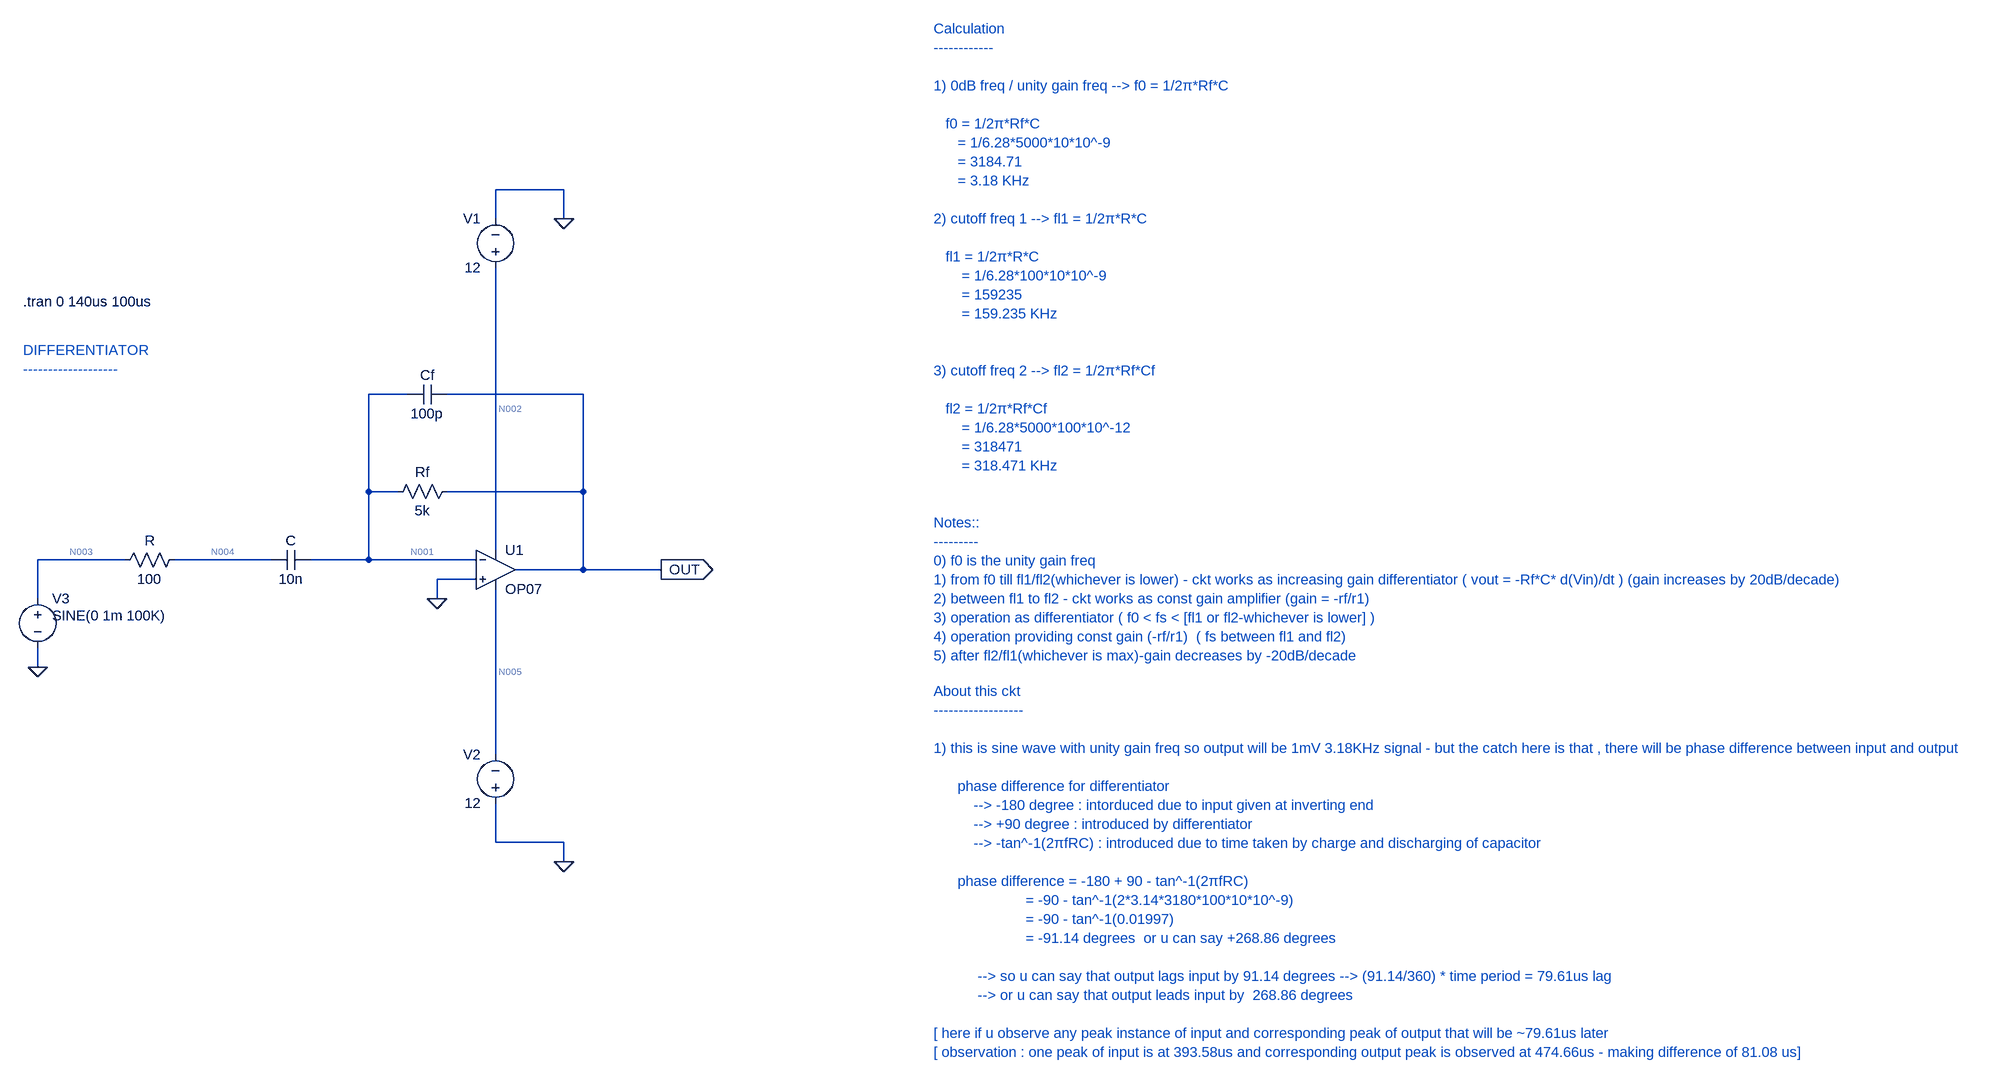
[diagram p0: schematic Op_amp_as_DIFFERENTIATOR_with_AC_input_at_freq_less_than_cutoff_freq.asc]
Op_amp_as_DIFFERENTIATOR_with_AC_input_at_freq_less_than_cutoff_freq.asc, the LTspice schematic file:
Version 4.1
SHEET 1 3496 1680
WIRE 192 -544 80 -544
WIRE 80 -496 80 -544
WIRE 192 -496 192 -544
WIRE -64 -208 -128 -208
WIRE 224 -208 0 -208
WIRE -128 -48 -128 -208
WIRE -80 -48 -128 -48
WIRE 224 -48 224 -208
WIRE 224 -48 0 -48
WIRE 80 48 80 -416
WIRE -528 64 -672 64
WIRE -288 64 -448 64
WIRE -128 64 -128 -48
WIRE -128 64 -224 64
WIRE 48 64 -128 64
WIRE 224 80 224 -48
WIRE 224 80 112 80
WIRE 352 80 224 80
WIRE 48 96 -16 96
WIRE -672 128 -672 64
WIRE -16 128 -16 96
WIRE -672 240 -672 208
WIRE 80 384 80 112
WIRE 80 528 80 464
WIRE 192 528 80 528
WIRE 192 560 192 528
FLAG 192 -496 0
FLAG 192 560 0
FLAG -672 240 0
FLAG 352 80 OUT
IOPIN 352 80 Out
FLAG -16 128 0
SYMBOL voltage 80 -400 R180
WINDOW 0 24 96 Left 2
WINDOW 3 24 16 Left 2
WINDOW 123 0 0 Left 0
WINDOW 39 0 0 Left 0
SYMATTR InstName V1
SYMATTR Value 12
SYMBOL voltage 80 480 R180
WINDOW 0 24 96 Left 2
WINDOW 3 24 16 Left 2
WINDOW 123 0 0 Left 0
WINDOW 39 0 0 Left 0
SYMATTR InstName V2
SYMATTR Value 12
SYMBOL OpAmps\\OP07 80 16 R0
SYMATTR InstName U1
SYMBOL res -432 48 R90
WINDOW 0 0 56 VBottom 2
WINDOW 3 32 56 VTop 2
SYMATTR InstName R
SYMATTR Value 100
SYMBOL voltage -672 112 R0
WINDOW 123 0 0 Left 0
WINDOW 39 0 0 Left 0
WINDOW 3 24 44 Left 2
SYMATTR Value SINE(0 1m 100K)
SYMATTR InstName V3
SYMBOL cap -224 48 R90
WINDOW 0 0 32 VBottom 2
WINDOW 3 32 32 VTop 2
SYMATTR InstName C
SYMATTR Value 10n
SYMBOL res 16 -64 R90
WINDOW 0 0 56 VBottom 2
WINDOW 3 32 56 VTop 2
SYMATTR InstName Rf
SYMATTR Value 5k
SYMBOL cap 0 -224 R90
WINDOW 0 0 32 VBottom 2
WINDOW 3 32 32 VTop 2
SYMATTR InstName Cf
SYMATTR Value 100p
TEXT -696 -360 Left 2 !.tran 0 140us 100us
TEXT -696 -280 Left 2 ;DIFFERENTIATOR\n-------------------
TEXT 800 -808 Left 2 ;Calculation\n------------\n \n1) 0dB freq / unity gain freq --> f0 = 1/2π*Rf*C\n \n   f0 = 1/2π*Rf*C\n      = 1/6.28*5000*10*10^-9\n      = 3184.71\n      = 3.18 KHz\n \n2) cutoff freq 1 --> fl1 = 1/2π*R*C\n \n   fl1 = 1/2π*R*C\n       = 1/6.28*100*10*10^-9\n       = 159235\n       = 159.235 KHz\n \n \n3) cutoff freq 2 --> fl2 = 1/2π*Rf*Cf\n \n   fl2 = 1/2π*Rf*Cf\n       = 1/6.28*5000*100*10^-12\n       = 318471\n       = 318.471 KHz\n \n \nNotes::\n---------\n0) f0 is the unity gain freq\n1) from f0 till fl1/fl2(whichever is lower) - ckt works as increasing gain differentiator ( vout = -Rf*C* d(Vin)/dt ) (gain increases by 20dB/decade)\n2) between fl1 to fl2 - ckt works as const gain amplifier (gain = -rf/r1)\n3) operation as differentiator ( f0 < fs < [fl1 or fl2-whichever is lower] )\n4) operation providing const gain (-rf/r1)  ( fs between fl1 and fl2)\n5) after fl2/fl1(whichever is max)-gain decreases by -20dB/decade
TEXT 800 280 Left 2 ;About this ckt\n------------------\n \n1) this is sine wave with unity gain freq so output will be 1mV 3.18KHz signal - but the catch here is that , there will be phase difference between input and output\n \n      phase difference for differentiator \n          --> -180 degree : intorduced due to input given at inverting end\n          --> +90 degree : introduced by differentiator\n          --> -tan^-1(2πfRC) : introduced due to time taken by charge and discharging of capacitor \n \n      phase difference = -180 + 90 - tan^-1(2πfRC)\n                       = -90 - tan^-1(2*3.14*3180*100*10*10^-9)\n                       = -90 - tan^-1(0.01997)\n                       = -91.14 degrees  or u can say +268.86 degrees\n \n           --> so u can say that output lags input by 91.14 degrees --> (91.14/360) * time period = 79.61us lag \n           --> or u can say that output leads input by  268.86 degrees       \n \n[ here if u observe any peak instance of input and corresponding peak of output that will be ~79.61us later\n[ observation : one peak of input is at 393.58us and corresponding output peak is observed at 474.66us - making difference of 81.08 us]

The netlist it stands for:
* Op_amp_as_DIFFERENTIATOR_with_AC_input_at_freq_less_than_cutoff_freq.asc
V1 N002 0 12
V2 0 N005 12
X§U1 0 N001 N002 N005 OUT LT1001  ; OP07, pins In+ In- V+ V- OUT
R N004 N003 100
V3 N003 0 SINE(0 1m 100K)
C N001 N004 10n
Rf OUT N001 5k
Cf OUT N001 100p
.tran 0 140us 100us
* DIFFERENTIATOR
* -------------------
* Calculation
* ------------
* 1) 0dB freq / unity gain freq --> f0 = 1/2π*Rf*C
*    f0 = 1/2π*Rf*C
*       = 1/6.28*5000*10*10^-9
*       = 3184.71
*       = 3.18 KHz
* 2) cutoff freq 1 --> fl1 = 1/2π*R*C
*    fl1 = 1/2π*R*C
*        = 1/6.28*100*10*10^-9
*        = 159235
*        = 159.235 KHz
* 3) cutoff freq 2 --> fl2 = 1/2π*Rf*Cf
*    fl2 = 1/2π*Rf*Cf
*        = 1/6.28*5000*100*10^-12
*        = 318471
*        = 318.471 KHz
* Notes::
* ---------
* 0) f0 is the unity gain freq
* 1) from f0 till fl1/fl2(whichever is lower) - ckt works as increasing gain differentiator ( vout = -Rf*C* d(Vin)/dt ) (gain increases by 20dB/decade)
* 2) between fl1 to fl2 - ckt works as const gain amplifier (gain = -rf/r1)
* 3) operation as differentiator ( f0 < fs < [fl1 or fl2-whichever is lower] )
* 4) operation providing const gain (-rf/r1)  ( fs between fl1 and fl2)
* 5) after fl2/fl1(whichever is max)-gain decreases by -20dB/decade
* About this ckt
* ------------------
* 1) this is sine wave with unity gain freq so output will be 1mV 3.18KHz signal - but the catch here is that , there will be phase difference between input and output
*       phase difference for differentiator
*           --> -180 degree : intorduced due to input given at inverting end
*           --> +90 degree : introduced by differentiator
*           --> -tan^-1(2πfRC) : introduced due to time taken by charge and discharging of capacitor
*       phase difference = -180 + 90 - tan^-1(2πfRC)
*                        = -90 - tan^-1(2*3.14*3180*100*10*10^-9)
*                        = -90 - tan^-1(0.01997)
*                        = -91.14 degrees  or u can say +268.86 degrees
*            --> so u can say that output lags input by 91.14 degrees --> (91.14/360) * time period = 79.61us lag
*            --> or u can say that output leads input by  268.86 degrees
* [ here if u observe any peak instance of input and corresponding peak of output that will be ~79.61us later
* [ observation : one peak of input is at 393.58us and corresponding output peak is observed at 474.66us - making difference of 81.08 us]
.lib LTC.lib
.backanno
.end

* Results of the author's LTspice run, read from the files saved beside the schematic
* Operating Point, zero values left out:
*   V(n005) = -12 V
*   V(n002) = 12 V
*   I(V1) = -2.25 mA
*   I(V2) = -2.25 mA
*   Ix(u1:3) = 2.25 mA
*   Ix(u1:4) = -2.25 mA
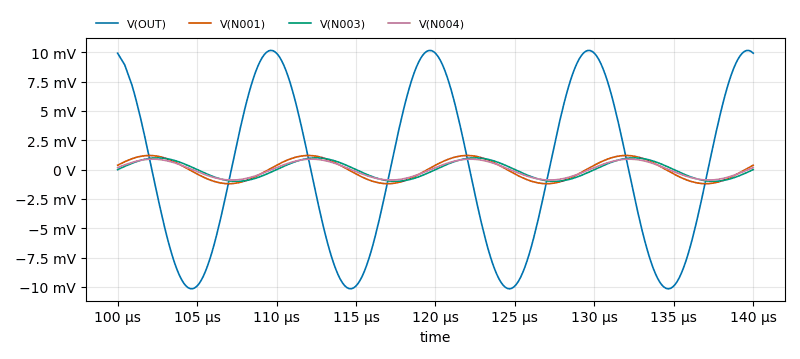
[diagram p1: Transient Analysis of Op_amp_as_DIFFERENTIATOR_with_AC_input_at_freq_less_than_cutoff_freq.asc, plotted from the saved traces]
* Transient Analysis, 1 run:
*   V(OUT): min -10.16 mV, max 10.16 mV, average -1.328 µV, rms 7.185 mV, last 9.92 mV
*   V(N001): min -1.202 mV, max 1.202 mV, average -112.7 nV, rms 849.8 µV, last 371.2 µV
*   V(N003): min -999.8 µV, max 1 mV, average -38.71 nV, rms 707 µV, last 0 V
*   V(N004): min -889.7 µV, max 889.8 µV, average -56.89 nV, rms 629 µV, last 169.9 µV